# Altium schematic sheet Main_Schematic.SchDoc
size 420 x 297 mm; SheetNumber: 1; SheetTotal: 1
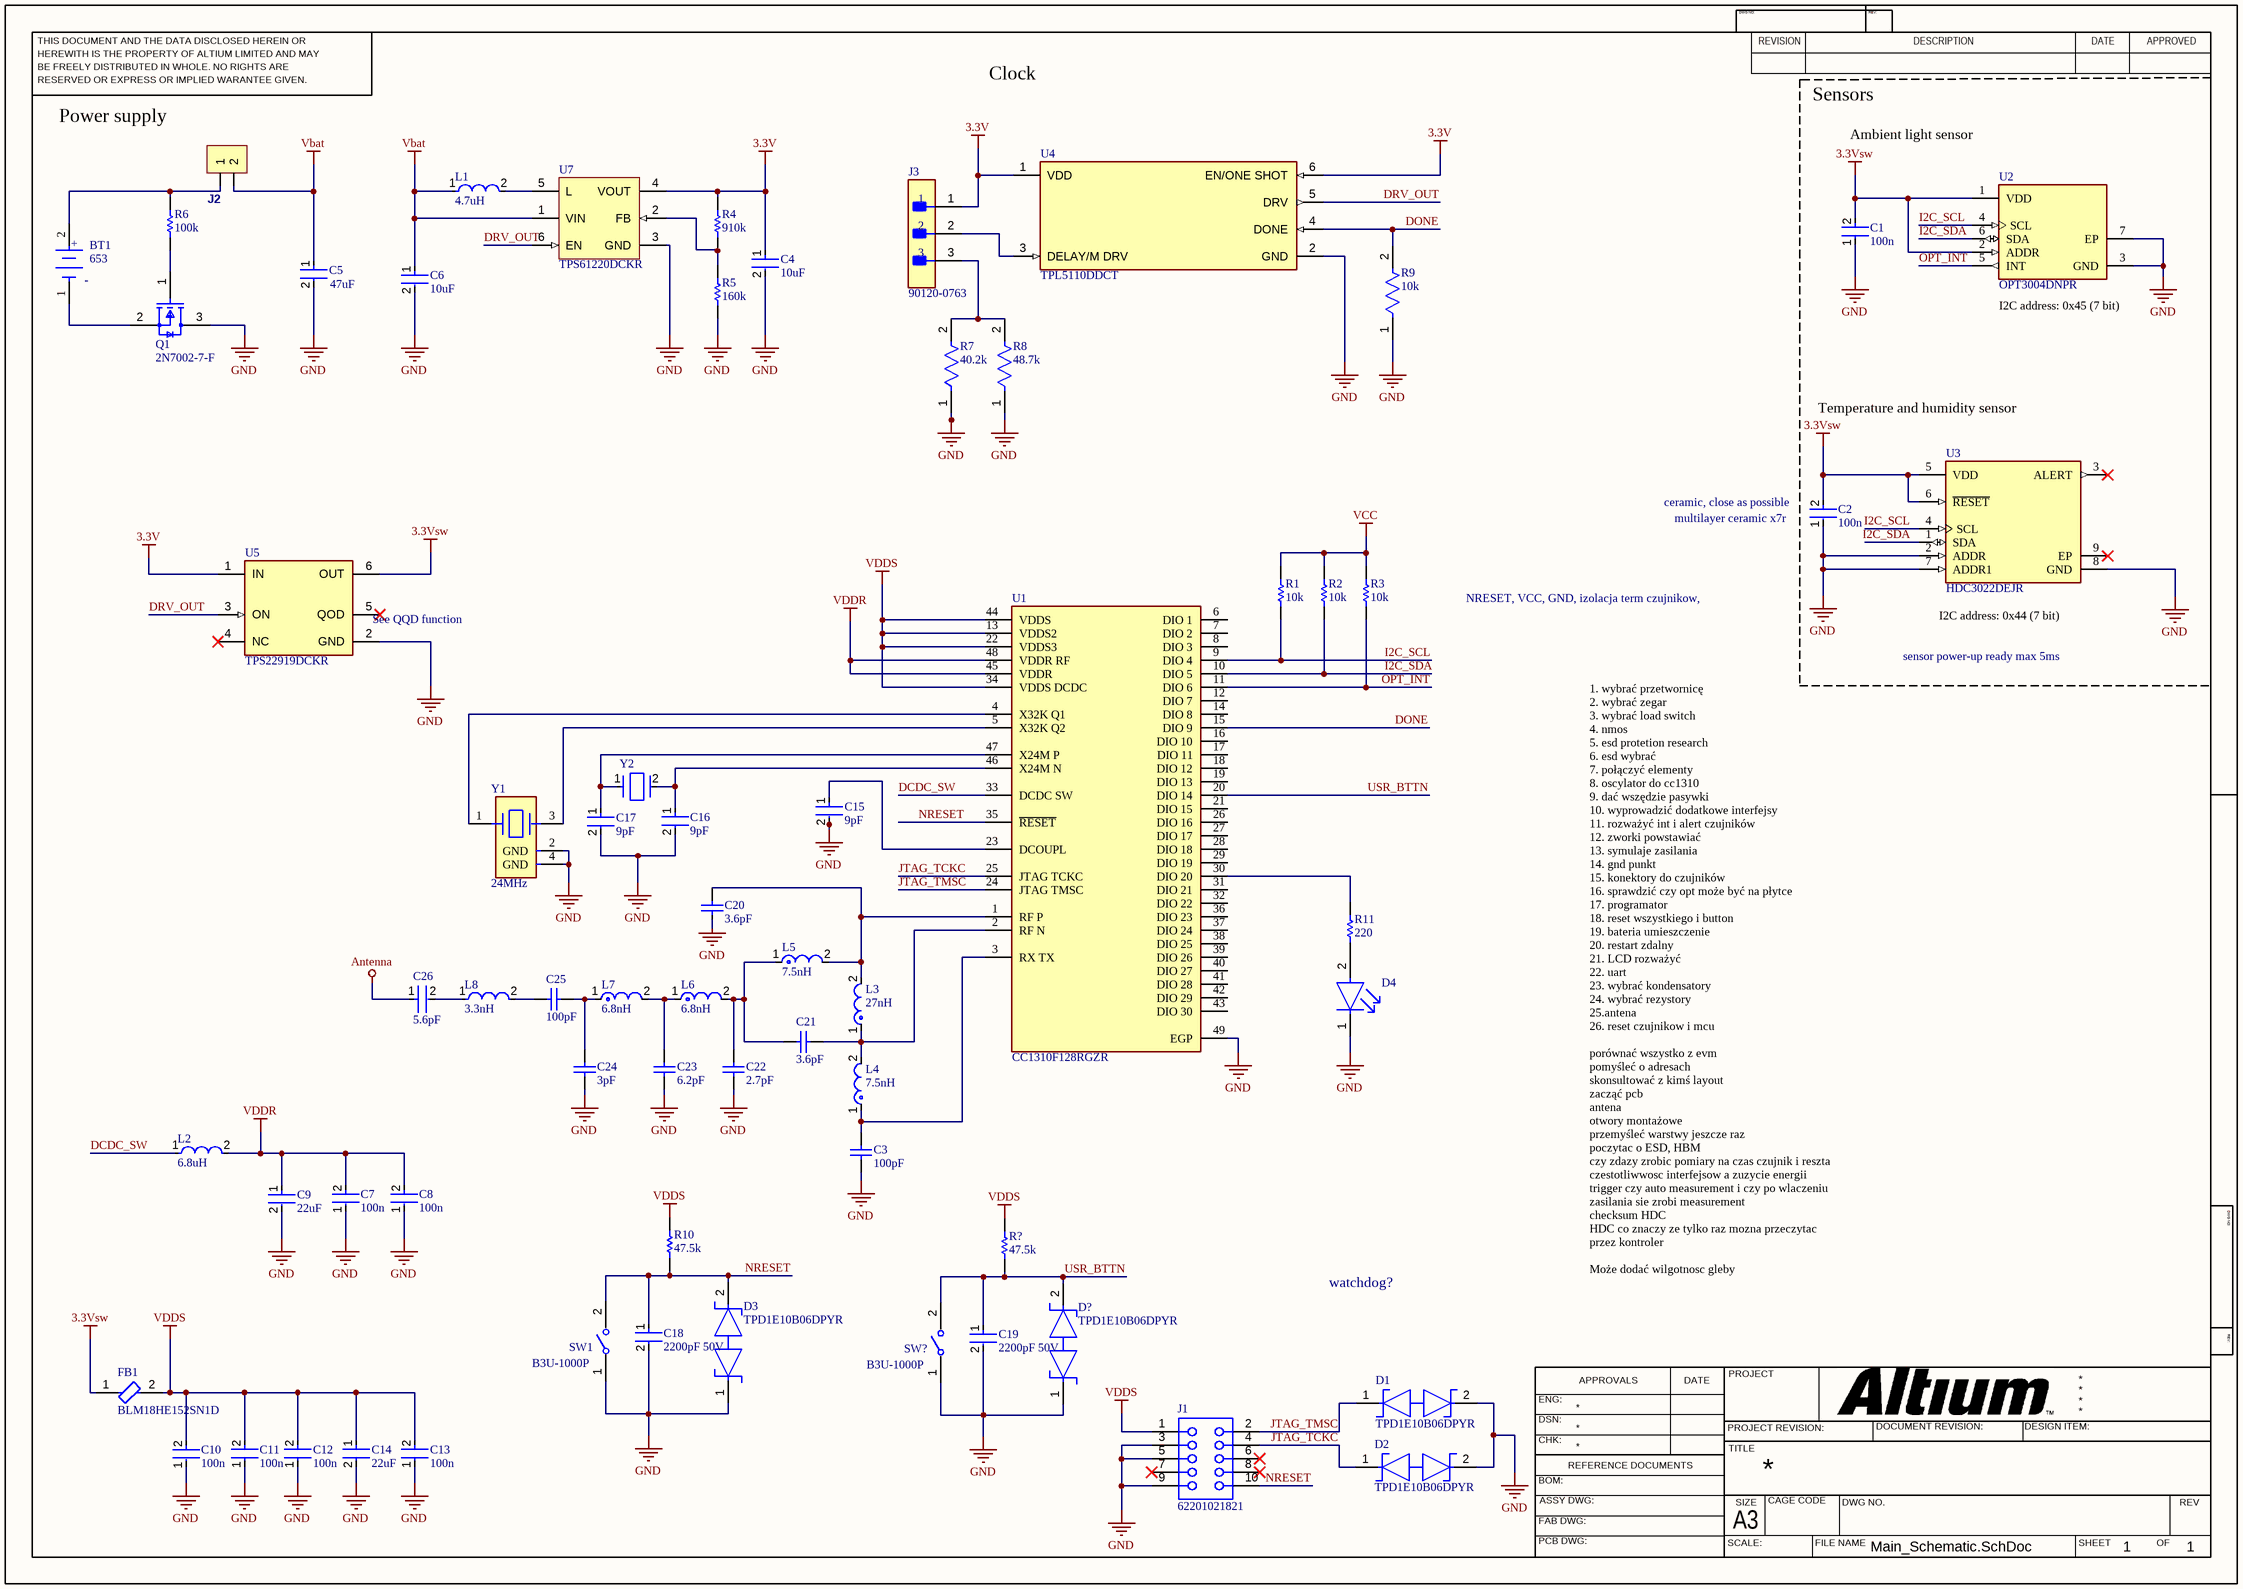
[diagram p0: Main_Schematic.SchDoc]

## Parts
BT1  653  [FP-653-MFG]
C1  100n  [FP-AC1210-0_85-MFG]
C2  100n  [FP-AC1210-0_85-MFG]
C3  100pF  [CAPC1005X55X25ML05T10]
C4  10uF  [FP-GRM188-0_2-MFG]
C5  47uF  [FP-GRM31C-0_2-e0_3_0_8-IPC_C]
C6  10uF  [FP-1210-L_3_3_0_4-W_2_5_0-IPC_A]
C7  100n  [FP-AC1210-0_85-MFG]
C8  100n  [FP-AC1210-0_85-MFG]
C9  22uF  [FP-GRM188-0_2-MFG]
C10  100n  [FP-AC1210-0_85-MFG]
C11  100n  [FP-AC1210-0_85-MFG]
C12  100n  [FP-AC1210-0_85-MFG]
C13  100n  [FP-AC1210-0_85-MFG]
C14  22uF  [FP-GRM188-0_2-MFG]
C15  9pF  [FP-GRM155-0_05-IPC_C]
C16  9pF  [FP-GRM155-0_05-IPC_C]
C17  9pF  [FP-GRM155-0_05-IPC_C]
C18  2200pF 50V  [FP-LLL185-0_1-IPC_B]
C19  2200pF 50V  [FP-LLL185-0_1-IPC_B]
C20  3.6pF  [CAPC1005X55X25ML05T10]
C21  3.6pF  [CAPC1005X55X25ML05T10]
C22  2.7pF  [CAPC1005X55X25LL05T10]
C23  6.2pF  [CAPC1005X55X25ML05T10]
C24  3pF  [CAPC1005X55X25LL05T10]
C25  100pF  [CAPC1005X55X25ML05T10]
C26  5.6pF  [FP-GRM033-0_03-IPC_B]
D1  TPD1E10B06DPYR  [FP-DPY0002A-MFG]
D2  TPD1E10B06DPYR  [FP-DPY0002A-MFG]
D3  TPD1E10B06DPYR  [FP-DPY0002A-MFG]
D4  LS L296-P2Q2-1-Z  [FP-LS_L296-MFG]  (value not drawn)
D?  TPD1E10B06DPYR  [FP-DPY0002A-MFG]
FB1  BLM18HE152SN1D  [FP-BLM18-0_15-t0_8-IPC_C]
J1  62201021821  [62201021821]
J2  CN_2x1  [GP_2x1]  (value not drawn)
J3  90120-0763  [FP-90120-0763-MFG]
L1  4.7uH  [FP-LQH3NPH_ME-MFG]
L2  6.8uH  [FP-MLZ2012-0_85-IPC_A]
L3  27nH  [FP-LQG15HH_02-IPC_C]
L4  7.5nH  [FP-LQG15HH_02-IPC_B]
L5  7.5nH  [FP-LQG15HH_02-IPC_B]
L6  6.8nH  [FP-LQG15HH_02-IPC_A]
L7  6.8nH  [FP-LQG15HH_02-IPC_A]
L8  3.3nH  [FP-LQW15AN_00-W0_6-0_1-MFG]
Q1  2N7002-7-F  [FP-SOT23-MFG]
R1  value 10k  (hidden comment: Resistor)
R2  value 10k  (hidden comment: Resistor)
R3  value 10k  (hidden comment: Resistor)
R4  910k  [RESC3226X70X40NL20T20]
R5  160k  [RESC3225X60X45LL20T20]
R6  100k  [RESC0603(1608)_N]
R7  40.2k  [FP-MCT0603-IPC_A]
R8  48.7k  [FP-MCT0603-IPC_A]
R9  10k  [FP-RK73HW3A-IPC_A]
R10  47.5k  [RESC3225X75X50ML15T25]
R11  220  [RESC1005X40X25LL05T05]
R?  47.5k  [RESC3225X75X50ML15T25]
SW1  B3U-1000P  [FP-B3U-1000P-MFG]
SW?  B3U-1000P  [FP-B3U-1000P-MFG]
U1  CC1310F128RGZR  [FP-RGZ0048A-IPC_C]
U2  OPT3004DNPR  [FP-DNP0006A-MFG]
U3  HDC3022DEJR  [FP-DEJ0008A-C01-IPC_A]
U4  TPL5110DDCT  [FP-DDC0006A-MFG]
U5  TPS22919DCKR  [FP-DCK0006A-MFG]
U7  TPS61220DCKR  [DCK0006A_L]
Y1  24MHz  [FP-ABM8W-MFG]
Y2  (no value)  [FP-ABS07AIG-MFG]

## Nets
3.3V: C4.1 J3.1 R4.2 U4.1(VDD) U4.6(EN/ONE_SHOT) U5.1(IN) U7.4(VOUT)
3.3Vsw: C1.2 C2.2 FB1.1 U2.1(VDD) U2.2(ADDR) U3.5(VDD) U3.6(~{RESET}) U5.6(OUT)
Antenna: C26.1
GND: C1.1 C2.1 C3.1 C4.2 C5.2 C6.2 C7.1 C8.1 C9.2 C10.1 C11.1 C12.1 C13.1 C14.2 C15.2 C16.2 C17.2 C18.2 C19.2 C20.1 C22.1 C23.1 C24.1 D1.2 D2.2 D3.1 D4.1(C) D?.1 J1.3 J1.5 J1.9 Q1.3(D) R5.1 R7.1 R8.1 R9.1 SW1.1 SW?.1 U1.49(EGP) U2.3(GND) U2.7(EP) U3.2(ADDR) U3.7(ADDR1) U3.8(GND) U4.2(GND) U5.2(GND) U7.3(GND) Y1.2(GND) Y1.4(GND)
Vbat: C5.1 C6.1 J2.2 L1.1 U7.1(VIN)
VCC: R1.2 R2.2 R3.2
VDDR: C7.2 C8.2 C9.1 L2.2 U1.45(VDDR) U1.48(VDDR_RF)
VDDS: C10.2 C11.2 C12.2 C13.2 C14.1 FB1.2 J1.1 R10.2 R?.2 U1.13(VDDS2) U1.22(VDDS3) U1.34(VDDS_DCDC) U1.44(VDDS)
DCDC_SW: L2.1 U1.33(DCDC_SW)
DONE: R9.2 U1.15(DIO_9) U4.4(DONE)
DRV_OUT: U4.5(DRV) U5.3(ON) U7.6(EN)
I2C_SCL: R1.1 U1.9(DIO_4) U2.4(SCL) U3.4(SCL)
I2C_SDA: R2.1 U1.10(DIO_5) U2.6(SDA) U3.1(SDA)
JTAG_TCKC: D2.1 J1.4 U1.25(JTAG_TCKC)
JTAG_TMSC: D1.1 J1.2 U1.24(JTAG_TMSC)
NRESET: C18.1 D3.2 J1.10 R10.1 SW1.2 U1.35(~{RESET})
OPT_INT: R3.1 U1.11(DIO_6) U2.5(INT)
USR_BTTN: C19.1 D?.2 R?.1 SW?.2 U1.20(DIO_14)
NetBT1_1: BT1.1(C) Q1.2(S)
NetBT1_2: BT1.2(A) J2.1 R6.2
NetC3_2: C3.2 L4.1 U1.3(RX_TX)
NetC15_1: C15.1 U1.23(DCOUPL)
NetC16_1: C16.1 U1.46(X24M_N) Y2.2
NetC17_1: C17.1 U1.47(X24M_P) Y2.1
NetC20_2: C20.2 L3.2 L5.2 U1.1(RF_P)
NetC21_1: C21.1 L3.1 L4.2 U1.2(RF_N)
NetC21_2: C21.2 C22.2 L5.1 L6.2
NetC23_2: C23.2 L6.1 L7.2
NetC24_2: C24.2 C25.1 L7.1
NetC25_2: C25.2 L8.2
NetC26_2: C26.2 L8.1
NetD4_2: D4.2(A) R11.2
NetJ3_2: J3.2 U4.3(DELAY/M_DRV)
NetJ3_3: J3.3 R7.2 R8.2
NetL1_2: L1.2 U7.5(L)
NetQ1_1: Q1.1(G) R6.1
NetR4_1: R4.1 R5.2 U7.2(FB)
NetR11_1: R11.1 U1.30(DIO_20)
NetU1_4: U1.4(X32K_Q1) Y1.1
NetU1_5: U1.5(X32K_Q2) Y1.3

Not connected (* = marked no-connect by the designer): J1 6* 7* 8*; U1 6(DIO_1) 7(DIO_2) 8(DIO_3) 12(DIO_7) 14(DIO_8) 16(DIO_10) 17(DIO_11) 18(DIO_12) 19(DIO_13) 21(DIO_15) 26(DIO_16) 27(DIO_17) 28(DIO_18) 29(DIO_19) 31(DIO_21) 32(DIO_22) 36(DIO_23) 37(DIO_24) 38(DIO_25) 39(DIO_26) 40(DIO_27) 41(DIO_28) 42(DIO_29) 43(DIO_30); U3 3(ALERT)* 9(EP)*; U5 4(NC)* 5(QOD)*

## Notes on the sheet
- Power supply
- Clock
- Sensors
- Ambient light sensor
- (near U2) I2C address: 0x45 (7 bit)
- Temperature and humidity sensor
- (near C2) ceramic, close as possible
- (near C2) multilayer ceramic x7r
- (near U5) See QQD function
- NRESET, VCC, GND, izolacja term czujnikow,
- sensor power-up ready max 5ms
- (near U3) I2C address: 0x44 (7 bit)
- watchdog?
- 1. wybrać przetwornicę
  2. wybrać zegar
  3. wybrać load switch
  4. nmos
  5. esd protetion research
  6. esd wybrać
  7. połączyć elementy
  8. oscylator do cc1310
  9. dać wszędzie pasywki
  10. wyprowadzić dodatkowe interfejsy
  11. rozważyć int i alert czujników
  12. zworki powstawiać
  13. symulaje zasilania
  14. gnd punkt
  15. konektory do czujników
  16. sprawdzić czy opt może być na płytce
  17. programator
  18. reset wszystkiego i button
  19. bateria umieszczenie
  20. restart zdalny
  21. LCD rozważyć
  22. uart
  23. wybrać kondensatory
  24. wybrać rezystory
  25.antena
  26. reset czujnikow i mcu
  porównać wszystko z evm
  pomyśleć o adresach
  skonsultować z kimś layout
  zacząć pcb
  antena
  otwory montażowe
  przemyśleć warstwy jeszcze raz
  poczytac o ESD, HBM
  czy zdazy zrobic pomiary na czas czujnik i reszta
  czestotliwwosc interfejsow a zuzycie energii
  trigger czy auto measurement i czy po wlaczeniu zasilania sie zrobi measurement
  checksum HDC
  HDC co znaczy ze tylko raz mozna przeczytac przez kontroler
  Może dodać wilgotnosc gleby
- THIS DOCUMENT AND THE DATA DISCLOSED HEREIN OR
- HEREWITH IS THE PROPERTY OF ALTIUM LIMITED AND MAY
- DWG NO:
- REVISION
- REV:
- DESCRIPTION
- DATE
- APPROVED
- BE FREELY DISTRIBUTED IN WHOLE. NO RIGHTS ARE
- RESERVED OR EXPRESS OR IMPLIED WARANTEE GIVEN.
- ENG:
- APPROVALS
- PROJECT
- DSN:
- CHK:
- REFERENCE DOCUMENTS
- PROJECT REVISION:
- TITLE
- DOCUMENT REVISION:
- DESIGN ITEM:
- BOM:
- FAB DWG:
- PCB DWG:
- ASSY DWG:
- SCALE:
- A3
- SIZE
- CAGE CODE
- FILE NAME
- DWG NO.
- SHEET
- OF
- REV
- (in symbol CMP-144256-000001-1) +; -

## Library data of the parts
BT1 = CMP-144256-000001-1: Adafruit Accessories Sewable CR2032 Battery Holder; Mount: Holder; Length: 4inch; Width: 2inch; Height: 0.5inch; Weight: 0.01lb
C1 C2 C7 C8 C10-C13 = CMP-03422-000642-1: AC1210KKX7R0BB104 CAP CER 0.1UF 100V X7R 1210; Manufacturer: Yageo; Automotive Grade: Grade 1; Description: AC1210 100 nF X7R 10.00% 100 V; Capacitance: 100 nF; Material: Ceramic; Value: 100 nF; Temperature Coefficient: 15%; Tolerance: 0.1; Automotive: Yes; ComponentLink2Description: Datasheet; Device Class L2: Capacitors; Height: 0.95mm; Manufacturer Part Number: AC1210KKX7R0BB104; Temperature: -55°C to +125°C; Voltage Rating: 100 V; Device Class L1: Passive Components; ComponentLink2URL: http://www.yageo.com/documents/recent/UPY-AC_NP0X7R_16V-to-630V_12.pdf; Lead Free: Yes; Category: Cap; Temperature Range High: +125°C; RoHS: TRUE; Digikey Description: CAP CER 0.1UF 100V X7R 1210; Temperature Range Low: -55°C; Octopart: https://octopart.com/ac1210kkx7r0bb104-yageo-78873719; Device Class L3: Ceramic Capacitors; Ipc Land Pattern Name: CAPC320250X85; Package: AC1210-0.85; Footprint Url: http://www.yageo.com/exep/pages/download/literatures/UPY-C_GEN_24.pdf; Temperature Characteristic: X7R
C3 C25 = CMP-2008-03915-1: GRM1555C1H101JA01D; Manufacturer: Murata; Part Number: GRM1555C1H101JA01D
C4 = CMP-06035-041415-1: GRM188C81A106KA73D Chip Multilayer Ceramic Capacitors for General Purpose, 0603, 10uF, X6S, 22%, 10%, 10V; Voltage Rating (DC): 10V; Thickness: 800um; Length: 1.6mm; Dielectric: X6S; Width: 800um; Tolerance: 10%; Capacitance: 10uF
C5 = CMP-2000-05255-3: GRM31CR61A476ME15L Chip Multilayer Ceramic Capacitors for General Purpose, 1206, 47uF, X5R, 15%, 20%, 10V; Case/Package: 1206; Radiation Hardening: No; Case Code (Metric): 3216; Max Operating Temperature: 85°C; Capacitance: 47uF; Tolerance: 20%; REACH SVHC: No SVHC; Depth: 1.6mm; Case Code (Imperial): 1206; Termination: SMD/SMT; Voltage Rating (DC): 10V; Package Quantity: 2000; Voltage Rating: 10V; Width: 1.6mm; Lead Free: Lead Free; Voltage: 10V; Packaging: Tape and Reel; Length: 3.2mm; Height: 1.6mm; Number of Pins: 2; Thickness: 0.071inch; Min Operating Temperature: -55°C; Dielectric: X5R; Mount: Surface Mount
C6 = CMP-1038-02198-3: 1210ZC106KAT2A CAP CER 10UF 10V X7R 1210; Dissipation Factor: 5%; Tolerance: 10%; Capacitance: 10uF; Voltage Rating (DC): 10V; Case Code (Imperial): 1210; Termination: SMD/SMT; Min Operating Temperature: -55°C; Max Operating Temperature: 125°C; Voltage: 10V; RoHS Compliant: Yes; Lead Free: Lead Free; Construction: Flat; Case/Package: 1210; Dielectric: X7R; Width: 0.098inch; REACH SVHC: No SVHC; Mount: Surface Mount; Case Code (Metric): 3225; Depth: 2.5mm; Series: 1210; Voltage Rating: 10V; Packaging: Tape and Reel; Length: 3.2mm; Thickness: 0.11inch; Package Quantity: 1; Height: 2.79mm; Radiation Hardening: No
C9 C14 = CMP-06035-041415-1: Ceramic Capacitors for General Purpose, 0603,; Voltage Rating (DC): 10V; Dielectric: X6S; Tolerance: 10%; Capacitance: 10uF; Thickness: 800um; Length: 1.6mm; Width: 800um
C15 = CMP-2008-04573-2: GRM155R61C105KA12D Chip Multilayer Ceramic Capacitors for General Purpose, 0402, 1.0uF, X5R, 15%, 10%, 16V; Capacitance: 1uF; Case Code (Imperial): 0402; Max Operating Temperature: 85°C; Mount: Surface Mount; Voltage Rating (DC): 16V; Material: Ceramic; Depth: 0.5mm; Voltage: 16V; Height: 0.5mm; Dielectric: X5R; Thickness: 0.022inch; Lead Free: Lead Free; Min Operating Temperature: -55°C; Packaging: Tape and Reel; Radiation Hardening: No; Case/Package: 0402; Width: 0.02inch; Length: 1mm; REACH SVHC: No SVHC; Case Code (Metric): 1005; Voltage Rating: 16V; Tolerance: 10%
C16 C17 = CMP-2008-04573-2: Voltage Rating (DC): 16V; Material: Ceramic; Capacitance: 1uF; Dielectric: X5R; Tolerance: 10%; Case Code (Imperial): 0402; Max Operating Temperature: 85°C; Mount: Surface Mount; Depth: 0.5mm; Voltage: 16V; Height: 0.5mm; Thickness: 0.022inch; Lead Free: Lead Free; Min Operating Temperature: -55°C; Packaging: Tape and Reel; Radiation Hardening: No; Case/Package: 0402; Width: 0.02inch; Length: 1mm; REACH SVHC: No SVHC; Case Code (Metric): 1005; Voltage Rating: 16V
C18 C19 = CMP-06035-054333-1: LLL185R71H222MA01L Cap Ceramic Monolithic 2200pF 20% 50V X7R 15% 0306 (0816M); Capacitance: 2.2nF; Dielectric: X7R; Min Operating Temperature: -55°C; Package Quantity: 1; Case Code (Metric): 0816; Radiation Hardening: No; Height: 0.6mm; Thickness: 0.024inch; Voltage Rating (DC): 50V; Max Operating Temperature: 125°C; Voltage Rating: 50V; Termination: SMD/SMT; Tolerance: 20%; Case/Package: 0306; Depth: 1.6mm; Width: 0.063inch; Mount: Surface Mount; Length: 0.8mm; Packaging: Tape and Reel; Case Code (Imperial): 0306; Lead Free: Lead Free
C20 C21 = CMP-2008-04357-1: GRM1555C1H3R6CA01D; Manufacturer: Murata; Part Number: GRM1555C1H3R6CA01D
C22 = CMP-2008-04328-1: GRM1555C1H2R7CA01D; Manufacturer: Murata; Part Number: GRM1555C1H2R7CA01D
C23 = CMP-1034-00476-2: GRM1555C1H6R2CA01D; Manufacturer: Murata; Part Number: GRM1555C1H6R2CA01D
C24 = CMP-2008-04347-1: GRM1555C1H3R0CA01D; Manufacturer: Murata; Part Number: GRM1555C1H3R0CA01D
C26 = CMP-2010-01151-2: GRM0335C1H5R6BA01J Chip Multilayer Ceramic Capacitors for General Purpose, 0201, 5.6pF, C0G, 30ppm/°C, 0.1pF, 50V; Thickness: 0.013inch; Packaging: Tape and Reel; Max Operating Temperature: 125°C; Width: 0.3mm; Voltage Rating (DC): 50V; Package Quantity: 50000; Mount: Surface Mount; Height: 0.3mm; Voltage Rating: 50V; Case Code (Imperial): 0201; Capacitance: 5.6pF; Case/Package: 0201; Termination: SMD/SMT; Case Code (Metric): 0603; Min Operating Temperature: -55°C; Length: 0.024inch; Dielectric: C0G
D1-D3 D? = CMP-0326-00004-4: TVS DIODE 5.5V 14V 2X1SON; Leakage Current: 100nA; Min Breakdown Voltage: 6V; Number of Channels: 1; ESD Protection: Yes; Power Line Protection: No; Test Current: 1mA; Interface: GPIO; Element Configuration: Single; Peak Pulse Current: 5A; Direction: Bidirectional; Peak Pulse Power: 90W; Capacitance: 12pF; Composition: Zener; Packaging: Tape and Reel; Number of Pins: 2; Breakdown Voltage: 6V; Radiation Hardening: No; Min Operating Temperature: -40°C; Contact Plating: Gold; Lead Free: Lead Free; Height: 0.35mm; REACH SVHC: No SVHC; Case/Package: 0402; Max Operating Temperature: 125°C; Width: 0.7mm; Clamping Voltage: 14V; Package Quantity: 1; Max Reverse Leakage Current: 100nA; Working Voltage: 5.5V; Length: 1.1mm; Number of Bidirectional Channels: 1; Reverse Standoff Voltage: 5.5V
D4 = CMP-62016-000006-2: LED RED DIFFUSED 0603 SMD; Forward Voltage: 2.3V; Dominant Wavelength: 633nm; Forward Current: 60mA; Luminous Flux: 0.32lm; Number of Elements: 1; Power Dissipation: 170mW; Test Current: 20mA; Luminous Intensity: 112mcd; Reverse Voltage: 12V; Viewing Angle: 160°; Length: 1.3mm; Number of Pins: 2; Depth: 0.8mm; Lens Style: Diffused; Min Operating Temperature: -40°C; Max Operating Temperature: 100°C; Case/Package: SMD/SMT; Radiation Hardening: No; Color: Red; Packaging: Tape and Reel; Number of LEDs: 1; Mount: Surface Mount
FB1 = CMP-0686-00368-3: Chip Ferrite Bead, 0603, 1500Ω @ 100MHz, 0.5Ω, 25%, 500mA; Impedance: 1.5kR; DC Resistance (DCR): 500mR; Number of Circuits: 1; Test Frequency: 100MHz; Case/Package: 0603; Max Operating Temperature: 125°C; Package Quantity: 1; Max DC Current: 500mA; Tolerance: 25%; Core Material: Ferrite; Width: 0.8mm; Number of Pins: 2; Depth: 0.8mm; Radiation Hardening: No; Case Code (Imperial): 0603; Min Operating Temperature: -55°C; Termination: SMD/SMT; Material: Ferrite; Military Standard: Not; Number of Lines: 1; DC Current: 500mA; Length: 1.6mm; REACH SVHC: No SVHC; Lead Free: Lead Free; Current Rating: 500mA; Max Current Rating: 500mA; Packaging: Tape and Reel; Case Code (Metric): 1608; Height: 0.8mm
J1 = CMP-1502-01181-3: NexarPartId: 65162211; Current Rating: 1A; Contact Resistance: 20mΩ; Operating Supply Voltage: 250V; Gender: Female; RoHS: Non-Compliant; Lead Pitch: 1.27mm; Number of Pins: 10; Orientation: Vertical
J2 = CMP-001-00125-1: Pins: 2; Design Item ID: CN_2x1; Component Type: Standard; Source: goldpin_male_sch.SchLib
J3 = CMP-04776-000084-1: CONN HEADER VERT 3POS 2.54MM; Manufacturer: Molex; Voltage Rating: 350V; Number Of Contacts: 3; Conn Orientation: Vertical; Current Rating: 3A; Conn Gender: Male; Package: 90120-0763; ComponentLink2Description: Datasheet; Height: 5.8mm; Manufacturer Part Number: 90120-0763; Temperature Range High: +125°C; RoHS: TRUE; ComponentLink2URL: https://www.molex.com/webdocs/datasheets/pdf/en-us/0901200763_PCB_HEADERS.pdf; Device Class L2: Headers and Wire Housings; Temperature: -55°C to +125°C; Device Class L1: Connectors; Pitch: 2.54mm; Footprint Url: https://www.molex.com/pdm_docs/sd/901200763_sd.pdf; Device Class L3: unset; Temperature Range Low: -55°C; Number Of Rows: 1; Category: Conn; Lead Free: Yes; Mouser Description: Board-To-Board Connector, C-Grid III 90120 Series, Through Hole, Header, 3, 2.54 mm; Octopart: https://octopart.com/90120-0763-molex-655433; Contact Material: Gold,Nickel; Automotive: No; Digikey Description: CONN HEADER VERT 3POS 2.54MM
L1 = CMP-06042-000007-2: LQH3NPZ4R7MMELWire Wound Ferrite Inductor for Power Lines For Automotive 4.7μH ±20% 0.12Ω 1700mA 1212; Shielding: Shielded; Saturation Current: 1.3A; Current Rating: 1.7A; DC Resistance (DCR): 120mR; Test Frequency: 1MHz; Self Resonant Frequency: 40MHz; Packaging: Cut Tape; Max Operating Temperature: 85°C; Min Operating Temperature: -40°C; Case/Package: 1212; Resistor Type: Wirewound; Inductance: 4.7uH; Mount: Surface Mount; Case Code (Imperial): 1212; Core Material: Ferrite; Ratings: AEC-Q200; Case Code (Metric): 3030; Tolerance: 20%
L2 = CMP-08253-000092-1: MLZ2012N6R8LT000 Shielded Multilayer Inductor 6.8uH ±20% 550mA 325mΩ SMD 0805; Test Frequency: 2MHz; Self Resonant Frequency: 60MHz; Saturation Current: 110mA; Core Material: Ferrite; DC Resistance (DCR): 250mR; Current Rating: 550mA; Case/Package: 0805; Height - Seated (Max): 0.057inch; Lead Free: Lead Free; Mount: Surface Mount; Max Operating Temperature: 125°C; Length: 0.079inch; Min Operating Temperature: -55°C; RoHS Compliant: Yes; Case Code (Imperial): 0805; Shielding: Shielded; Tolerance: 20%; Width: 0.049inch; Inductance: 6.8uH; Packaging: Tape and Reel; Package Quantity: 1; Case Code (Metric): 2012
L3 = CMP-2000-06578-2: LQG15HS27NJ02D Multilayer type RF Inductor 27nH ±5% 0.46Ω 350mA 0402; DC Current: 300mA; Core Material: Air; Self Resonant Frequency: 1.7GHz; Q Factor: 8; DC Resistance (DCR): 460mR; Shielding: Unshielded; Test Frequency: 100MHz; Inductance: 27nH; Width: 0.02inch; Length: 1mm; Height - Seated (Max): 0.022inch; Military Standard: Not; Case Code (Imperial): 0402; Tolerance: 5%; Depth: 0.55mm; Current Rating: 300mA; Inductance Tolerance: 5%; Lead Free: Lead Free; Height: 0.5mm; Max DC Current: 300mA; REACH SVHC: No SVHC; Package Quantity: 10000; Mount: Surface Mount; Termination: SMD/SMT; Case Code (Metric): 1005; Case/Package: 0402; Max Operating Temperature: 125°C; Packaging: Tape and Reel; Min Operating Temperature: -55°C
L4 L5 = CMP-06042-012234-1: LQG15HS7N5J02D Multilayer type RF Inductor 7.5nH ±5% 0.24Ω 550mA 0402; Q Factor: 8; DC Resistance (DCR): 240mR; DC Current: 300mA; Core Material: Air; Shielding: Unshielded; Self Resonant Frequency: 4.2GHz; Test Frequency: 100MHz; Height: 0.5mm; Case/Package: 0402; Min Operating Temperature: -55°C; Radiation Hardening: No; Packaging: Tape and Reel; Depth: 0.55mm; Lead Free: Lead Free; Package Quantity: 10000; Case Code (Metric): 1005; Case Code (Imperial): 0402; Inductance: 7.5nH; Mount: Surface Mount; Max Operating Temperature: 125°C; Termination: SMD/SMT; Height - Seated (Max): 0.022inch; Max DC Current: 300mA; Tolerance: 5%; Width: 0.5mm; Length: 1mm; Current Rating: 300mA; Military Standard: Not
L6 L7 = CMP-06042-003922-1: LQG15HS6N8J02D Multilayer type RF Inductor 6.8nH ±5% 0.22Ω 600mA 0402; Q Factor: 8; DC Current: 300mA; Self Resonant Frequency: 4.5GHz; DC Resistance (DCR): 240mR; Test Frequency: 100MHz; Core Material: Air; Shielding: Unshielded; Inductance: 6.8nH; Height: 0.5mm; Max Operating Temperature: 125°C; Height - Seated (Max): 0.022inch; Lead Free: Lead Free; Package Quantity: 10000; Min Operating Temperature: -55°C; Case/Package: 0402; Radiation Hardening: No; Case Code (Imperial): 0402; Depth: 0.55mm; Termination: SMD/SMT; Width: 0.02inch; Current Rating: 300mA; Max DC Current: 300mA; Tolerance: 5%; Length: 1mm; Military Standard: Not; Mount: Surface Mount; Case Code (Metric): 1005; Packaging: Tape and Reel
L8 = CMP-06042-008836-1: LQW15AN3N3D10D Wire Wound RF Inductor 3.3nH ±0.5nH 900mA 0.04Ω 0402 (1005); Core Material: Air; DC Resistance (DCR): 40mR; Shielding: Unshielded; Test Frequency: 100MHz; Self Resonant Frequency: 12GHz; Current: 800mA; Mount: Surface Mount; Current Rating: 900mA; Resistor Type: Wirewound; Case/Package: 0402; Inductance: 3.3nH; Military Standard: Not; Package Quantity: 10000; Number of Pins: 2; Length: 1mm; Lead Free: Lead Free; REACH SVHC: No SVHC; Max DC Current: 900mA; Max Operating Temperature: 125°C; Height - Seated (Max): 0.024inch; Width: 0.02inch; DC Current: 900mA; Termination: SMD/SMT; Packaging: Tape and Reel; Case Code (Imperial): 0402; Min Operating Temperature: -55°C; Case Code (Metric): 1005; Radiation Hardening: No; Height: 0.5mm; Weight: 2.8E-05oz; Depth: 0.7mm
Q1 = CMP-2000-04929-2: MOSFET N-CH 60V 115MA SOT23-3; Turn-On Delay Time: 7ns; Turn-Off Delay Time: 11ns; Drain to Source Resistance: 7.5R; Rise Time: 3ns; Drain to Source Breakdown Voltage: 70V; Input Capacitance: 50pF; Number of Elements: 1; Power Dissipation: 540mW; Max Power Dissipation: 300mW; Fall Time: 5.6ns; Gate to Source Voltage (Vgs): 20V; Threshold Voltage: 2.5V; Element Configuration: Single; Termination: SMD/SMT; Weight: 0.000282oz; Radiation Hardening: No; Max Operating Temperature: 150°C; On-State Resistance: 7.5R; Mount: Surface Mount; Current Rating: 115mA; Contact Plating: Tin; Lead Free: Lead Free; Min Operating Temperature: -55°C; Number of Pins: 3; REACH SVHC: No SVHC; Drain to Source Voltage (Vdss): 60V; Width: 1.3mm; Package Quantity: 3000; Length: 2.9mm; Case/Package: SOT-23; Number of Channels: 1; Dual Supply Voltage: 60V; Packaging: Tape and Reel; Height: 1mm; Voltage Rating (DC): 60V; Nominal Vgs: 2.5V; Continuous Drain Current (ID): 115mA; Voltage: 60V; Rds On Max: 7.5R
R1-R3 = Resistor: TC1: 0; SimulationGenericComponent: True; TC2: 0
R4 = CMP-2005-01878-1: RK73B2ETTD914J; Manufacturer: KOA Speer; Part Number: RK73B2ETTD914J
R5 = CMP-2005-00577-1: CRCW1210160KJNEA; Manufacturer: Vishay Dale; Part Number: CRCW1210160KJNEA
R6 = CMP-1012-00736-1: 100K 0.1W 1% 0603 (1608 Metric)  SMD; Value: 100000.00 Ohm; Case-Metric: 1608; Case-EIA: 0603; Power: 0.1 W; Tolerance: 1 %; Technology: SMT
R7 R8 = CMP-02407-001233-1: MCT06030C4029FP500 RES SMD 100 OHM 1% 1/8W 0603; Resistance: 40.2R; Depth: 0.85mm; Packaging: Tape and Reel; Tolerance: 1%; Composition: Thin Film; Military Standard: Not; Min Operating Temperature: -55°C; Length: 1.55mm; Width: 850um; Max Operating Temperature: 125°C; Lead Free: Lead Free; Case/Package: 0603
R9 = CMP-04015-094217-1: RK73HW3ATTE1002F 10kΩ ±1% 1W Chip Resistor 2512 Thick Film AEC-Q200 Qualified; Resistance: 10kR; Length: 6.3mm; Lead Free: Lead Free; Max Operating Temperature: 155°C; RoHS Compliant: Yes; Packaging: Tape and Reel; Depth: 3.1mm; Power Rating: 1W; Min Operating Temperature: -55°C; Military Standard: Not; Tolerance: 1%; Case/Package: 2512; Resistor Type: Thick Film
R10 R? = CMP-2005-00879-1: TNPW121047K5BETA; Manufacturer: Vishay Dale; Part Number: TNPW121047K5BETA
R11 = CMP-2002-08373-1: CRCW0402220RJNED; Manufacturer: Vishay Dale; Part Number: CRCW0402220RJNED
SW1 SW? = CMP-2100-03586-2: SWITCH TACTILE SPST-NO 0.05A 12V; Contact Resistance: 100mR; Operating Force: 1.5N; Max Current Rating: 50mA; Switch Travel: 0.15mm; Actuator Type: Standard; Mechanical Life: 200000Cycles; Ratings: Dust Proof; Illumination Type: Non-Illuminated; Throw Configuration: SPST; Actuator Length: 0.4mm; Switch Function: Off-Mom; Height: 1.2mm; Width: 3mm; Weight: 0.000776oz; Contact Material: Silver; Max Voltage Rating (DC): 12V; Insulation Resistance: 100MR; Lead Free: Lead Free; Current Rating: 50mA; Termination: SMD/SMT; Length: 4mm; Voltage Rating (DC): 12V; Contact Current Rating: 50mA; Orientation: Straight; Depth: 2.5mm; Max Operating Temperature: 70°C; Packaging: Tape and Reel; Min Operating Temperature: -25°C; Package Quantity: 1; Mount: Surface Mount; Electrical Life: 200000Cycles
U1 = CMP-04869-000048-1: IC RF TXRX+MCU ISM<1GHZ 48VFQFN; RAM Size: 20KB; Max Frequency: 1GHz; Memory Size: 128KB; Max Supply Voltage: 3.8V; Density: 131072B; Min Supply Voltage: 1.8V; Contact Plating: Gold; Max Operating Temperature: 85°C; Number of Pins: 48; Mount: Surface Mount; RoHS Compliant: Yes; Min Operating Temperature: -40°C; Lead Free: Lead Free
U2 = CMP-04942-000001-2: SENSOR OPT 550NM AMBIENT 6USON
U3 = CMP-00370-133473010-1: HDC3022DEJR 0.5% RH digital humidity sensor with permanent IP67 filter 8-WSON -40 to 125; Manufacturer Lifecycle Status: ACTIVE; Length: 2.5mm; Number of Pins: 8; Thickness: 800µm; Width: 2.5mm; Lifecycle Status: Production; NexarPartId: 133473010
U4 = CMP-04858-000011-1: IC OSC PROG TIMER TSOT23-6; Manufacturer: Texas Instruments; Number Of Timers/Counters: 1; Max Supply Voltage: 5.5V; Max Junction Temp: +150°C; Standoff Height: 0mm; Nominal Supply Current: 0.035uA; Min Supply Voltage: 1.8V; Mouser Description: Timers & Support Products Ultra Lw Pwr Timer; Device Class L1: Integrated Circuits (ICs); ComponentLink2Description: Datasheet; Temperature Range Low: -40°C; Height: 1.1mm; Package: DDC0006A; Manufacturer Part Number: TPL5110DDCT; Device Class L2: Clock and Timing; Automotive: No; Octopart: https://octopart.com/tpl5110ddct-texas+instruments-52670271; Lead Free: Yes; RoHS: TRUE; Category: IC; Digikey Description: IC OSC PROG TIMER TSOT23-6; Device Class L3: Timers and Oscillators; Temperature Range High: +105°C; Temperature: -40°C to +105°C; ComponentLink2URL: http://www.ti.com/lit/ds/symlink/tpl5110.pdf
U5 = CMP-04912-000027-1: POWER MANAGEMENT
U7 = CMP-0347-00054-2: Boost Voltage Converter with 0.7 to 5.5 V Input and 1.8 to 5.5 V Output, -40 to 85 degC, 6-Pin SC70 (DCK), Green (RoHS & no Sb/Br); Manufacturer: Texas Instruments; SubFamily: Step-Up Regulator; Vout(Min)(V): 1.8; Vout(Max)(V): 5.5; Switching Frequency(Max)(kHz): 2000; Vin(Min)(V): 0.7; Regulated Outputs(#): 1; PackageReference: DCK0006A; PackageVersion: revG, Jan-2007; ComponentLink2Description: Package Specification; Topology: Boost; ComponentLink2URL: http://www.ti.com/litv/pdf/mpds114c; PackageDescription: 6-Pin Plastic Small-Outline Package, 2 x 1.3 mm Body, 0.65 mm Pitch, 2.1 mm Lead Span; ComponentLink1Description: Datasheet; DatasheetVersion: SLVS776; ComponentLink1URL: http://www.ti.com/general/docs/lit/getliterature.tsp?genericPartNumber=TPS61220&fileType=pdf; PartNumber: TPS61220DCKR; Code_JEDEC: MO-203-AB; Eco-Plan: Green (RoHS & no Sb/Br); Vin(Max)(V): 5.5; Mounting Technology: Surface Mount
Y1 = CMP-27762-013939-3: ABM8W-24.0000MHZ-7-B1U-T3 Crystal 24MHz ±10ppm (Tol) ±10ppm (Stability) 7pF FUND 50Ω 4-Pin SMD T/R
Y2 = CMP-27762-015869-1: ABS07AIG-32.768KHZ-9-D-T Crystal 32.768kHz ±20ppm (Tol) 9pF FUND 70kΩ Automotive 2-Pin Mini-CSMD T/R; ESR (Equivalent Series Resistance): 70kR; Max Operating Temperature: 85°C; Frequency Tolerance: 20ppm; Frequency: 32.768kHz; Load Capacitance: 9pF; RoHS Compliant: Yes; Length: 0.126inch; Series: ABS07AIG; Width: 0.059inch; Mount: Surface Mount; Ratings: AEC-Q200; Min Operating Temperature: -40°C; Case/Package: SMD/SMT; Height: 0.035inch; Packaging: Cut Tape